# Altium schematic sheet ADPL_improved.SchDoc
size B
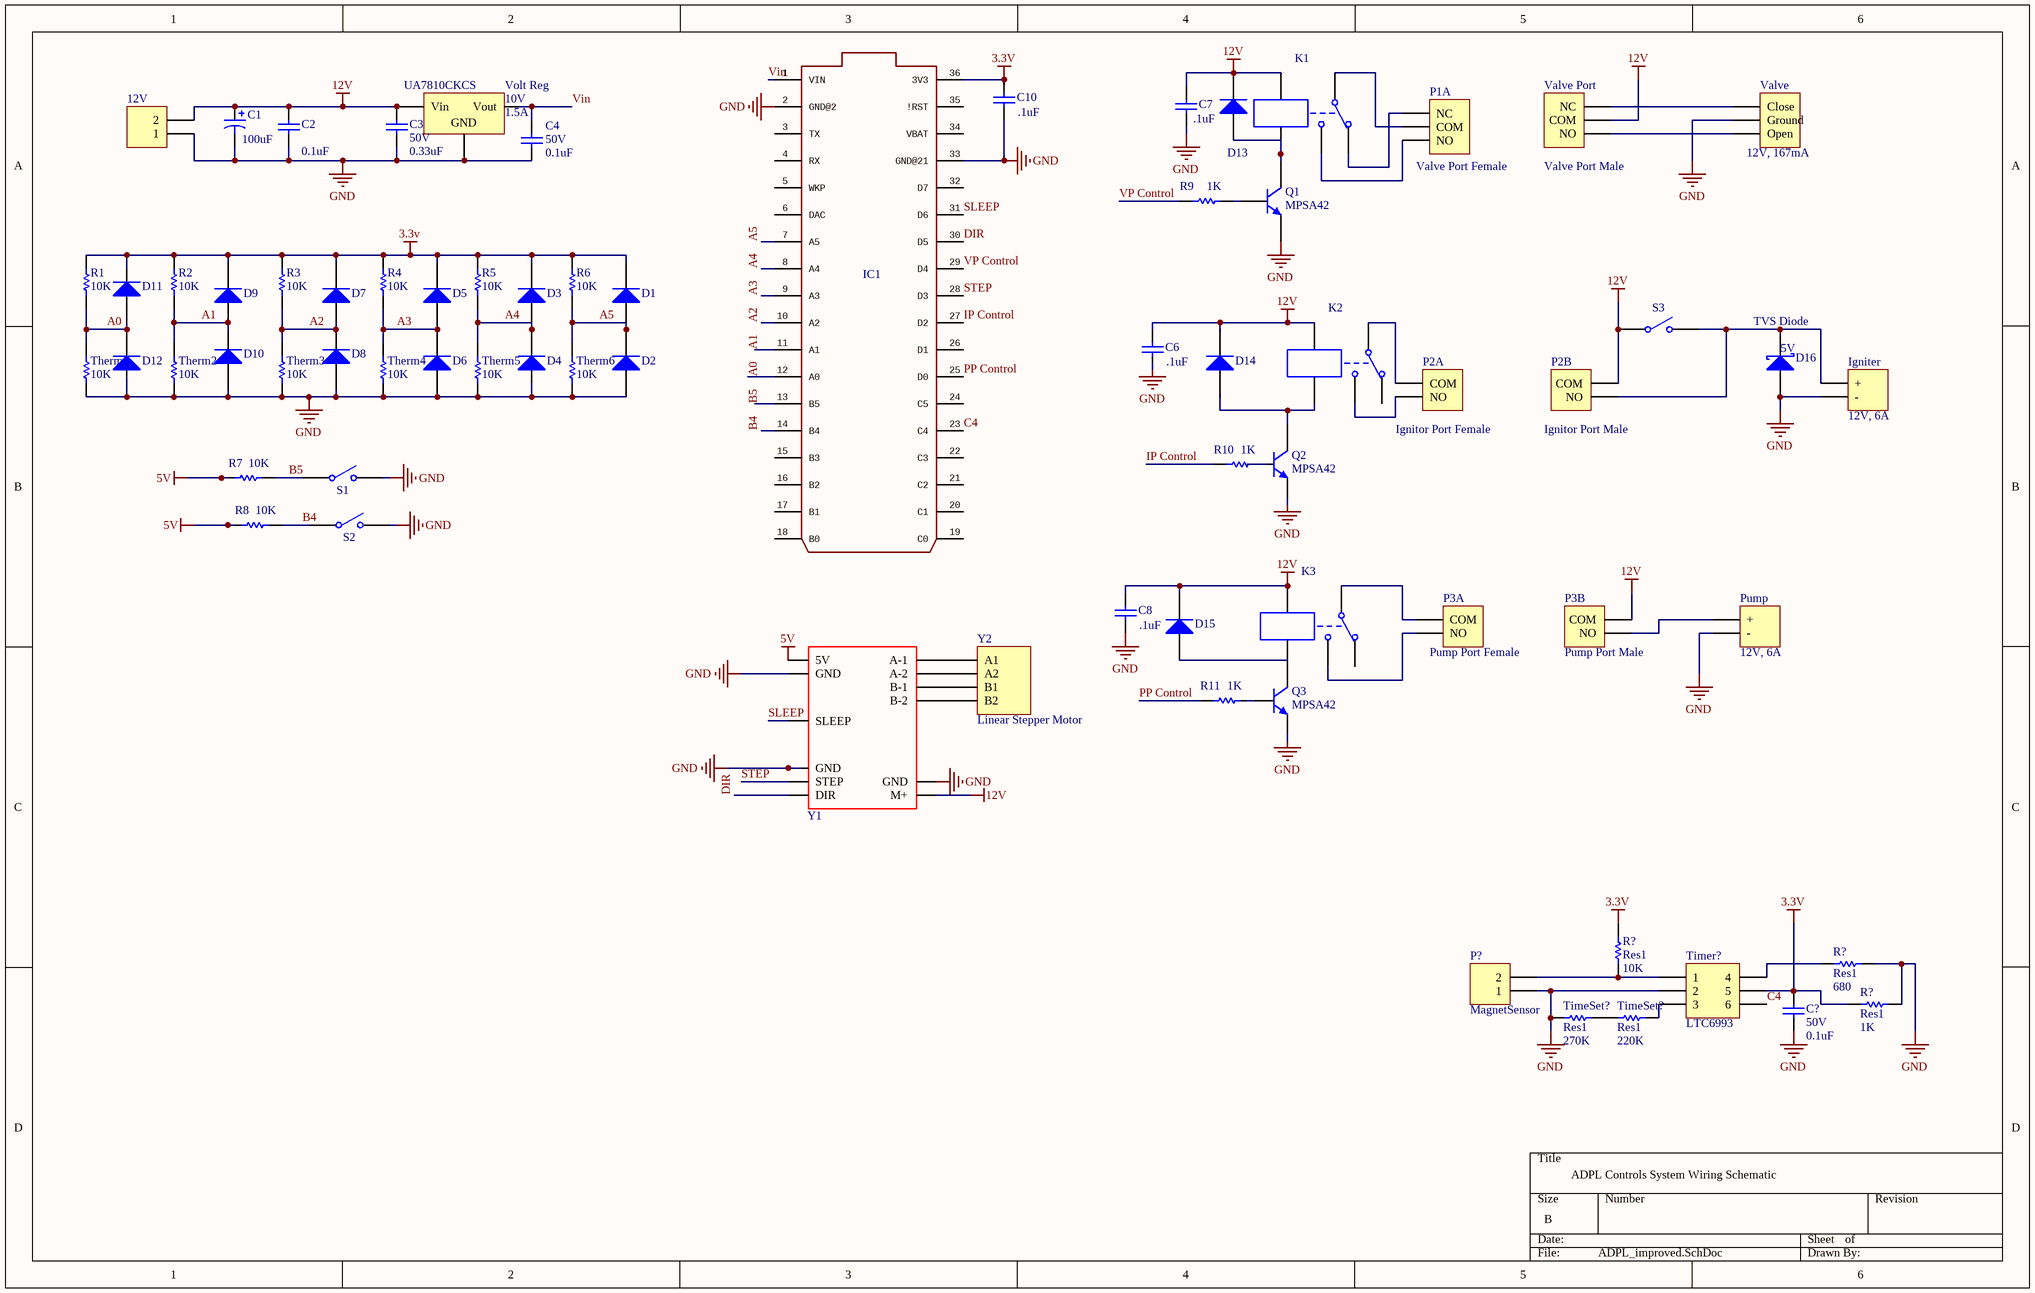
[diagram p0: ADPL_improved.SchDoc]

## Parts
(Parts that share a designator on the sheet are numbered #1, #2 ... from top to bottom, then left to right.)
12V  (no value)  [HDR1X2]
C1  value 100uF  [RB7.6-15]  (hidden comment: Cap)
C2  value 0.1uF  [C1206]  (hidden comment: Cap)
C3  50V  value 0.33uF  [RAD-0.3]
C4  50V  value 0.1uF  [RAD-0.3]
C6  value .1uF  [C1206]  (hidden comment: BYCap)
C7  value .1uF  [C1206]  (hidden comment: Cap)
C8  value .1uF  [C1206]  (hidden comment: BYCap)
C10  value .1uF  [C1206]  (hidden comment: BYCap)
C?  50V  value 0.1uF  [RAD-0.3]
D1  1N914  [DO-35]  (value not drawn)
D2  1N914  [DO-35]  (value not drawn)
D3  1N914  [DO-35]  (value not drawn)
D4  1N914  [DO-35]  (value not drawn)
D5  1N914  [DO-35]  (value not drawn)
D6  1N914  [DO-35]  (value not drawn)
D7  1N914  [DO-35]  (value not drawn)
D8  1N914  [DO-35]  (value not drawn)
D9  1N914  [DO-35]  (value not drawn)
D10  1N914  [DO-35]  (value not drawn)
D11  1N914  [DO-35]  (value not drawn)
D12  1N914  [DO-35]  (value not drawn)
D13  1N914  [DO-35]  (value not drawn)
D14  1N914  [DO-35]  (value not drawn)
D15  1N914  [DO-35]  (value not drawn)
D16  TVS Diode  Working Voltage: 5V  [TO-220AC]
IC1  Particle Electron  [ELECTRON]  (value not drawn)
Igniter  12V, 6A  [HDR1X2]
K1  Relay-SPDT  (value not drawn)
K2  Relay-SPDT  (value not drawn)
K3  Relay-SPDT  (value not drawn)
P1A  Valve Port Female
P2A  Ignitor Port Female
P2B  Ignitor Port Male
P3A  Pump Port Female
P3B  Pump Port Male
P?  MagnetSensor  [HDR1X2]
Pump  12V, 6A  [HDR1X2]
Q1  MPSA42  [TO-92A]
Q2  MPSA42  [TO-92A]
Q3  MPSA42  [TO-92A]
R1  value 10K  [AXIAL-0.3]  (hidden comment: Res1)
R2  value 10K  [AXIAL-0.3]  (hidden comment: Res1)
R3  value 10K  [AXIAL-0.3]  (hidden comment: Res1)
R4  value 10K  [AXIAL-0.3]  (hidden comment: Res1)
R5  value 10K  [AXIAL-0.3]  (hidden comment: Res1)
R6  value 10K  [AXIAL-0.3]  (hidden comment: Res1)
R7  value 10K  [AXIAL-0.3]  (hidden comment: Res1)
R8  value 10K  [AXIAL-0.3]  (hidden comment: Res1)
R9  value 1K  [AXIAL-0.3]  (hidden comment: Res1)
R10  value 1K  [AXIAL-0.3]  (hidden comment: R10)
R11  value 1K  [AXIAL-0.3]  (hidden comment: R11)
R?#1  Res1  value 10K  [AXIAL-0.3]
R?#2  Res1  value 680  [AXIAL-0.3]
R?#3  Res1  value 1K  [AXIAL-0.3]
S1  SW-SPST  [SPST-2]  (value not drawn)
S2  SW-SPST  [SPST-2]  (value not drawn)
S3  SW-SPST  [SPST-2]  (value not drawn)
Therm1  value 10K  [AXIAL-0.3]  (hidden comment: Res1)
Therm2  value 10K  [AXIAL-0.3]  (hidden comment: Res1)
Therm3  value 10K  [AXIAL-0.3]  (hidden comment: Res1)
Therm4  value 10K  [AXIAL-0.3]  (hidden comment: Res1)
Therm5  value 10K  [AXIAL-0.3]  (hidden comment: Res1)
Therm6  value 10K  [AXIAL-0.3]  (hidden comment: Res1)
Timer?  LTC6993  [LTC6993]
TimeSet?#1  Res1  value 270K  [AXIAL-0.3]
TimeSet?#2  Res1  value 220K  [AXIAL-0.3]
UA7810CKCS  Volt Reg  Voltage output: 10V  Current output: 1.5A  [D2PAK_N]
Valve  12V, 167mA  [HDR1X3]
Valve_Port  Valve Port Male
Y1  105990027  (value not drawn)
Y2  Linear Stepper Motor

## Nets
3.3V: C10.2 C?.1 D1.2(K) D3.2(K) D5.2(K) D7.2(K) D9.2(K) D11.2(K) IC1.36(3V3) R1.2 R2.2 R3.2 R4.2 R5.2 R6.2 R?#1.2 R?#3.2 Timer?.5
5V: R7.2 R8.2 Y1.?5(5V)
12V: 12V.2 C1.1 C2.2 C3.2 C6.2 C7.2 C8.2 D13.2(K) D14.2(K) D15.2(K) K1.4 K2.4 K3.4 P2B.2(COM) P3B.2(COM) S3.1(COMMON) UA7810CKCS.1(Vin) Valve_Port.2(COM) Y1.?7(M+)
GND: 12V.1 C1.2 C2.1 C3.1 C4.1 C6.1 C7.1 C8.1 C10.1 C?.2 D2.1(A) D4.1(A) D6.1(A) D8.1(A) D10.1(A) D12.1(A) D16.3(A) IC1.2(GND@2) IC1.33(GND@21) Igniter.2(-) P?.1 Pump.2(-) Q1.1(E) Q2.1(E) Q3.1(E) R?#2.1 R?#3.1 S1.2(NO) S2.2(NO) Therm1.1 Therm2.1 Therm3.1 Therm4.1 Therm5.1 Therm6.1 Timer?.2 TimeSet?#1.1 UA7810CKCS.2(GND) Valve.2(Ground) Y1.?1(GND) Y1.?6(GND) Y1.?8(GND)
A0: D11.1(A) D12.2(K) IC1.12(A0) R1.1 Therm1.2
A1: D9.1(A) D10.2(K) IC1.11(A1) R2.1 Therm2.2
A2: D7.1(A) D8.2(K) IC1.10(A2) R3.1 Therm3.2
A3: D5.1(A) D6.2(K) IC1.9(A3) R4.1 Therm4.2
A4: D3.1(A) D4.2(K) IC1.8(A4) R5.1 Therm5.2
A5: D1.1(A) D2.2(K) IC1.7(A5) R6.1 Therm6.2
B4: IC1.14(B4) R8.1 S2.1(COMMON)
B5: IC1.13(B5) R7.1 S1.1(COMMON)
C4: IC1.23(C4) Timer?.6
DIR: IC1.30(D5) Y1.?3(DIR)
IP Control: IC1.27(D2) R10.1
PP Control: IC1.25(D0) R11.1
SLEEP: IC1.31(D6) Y1.?4(SLEEP)
STEP: IC1.28(D3) Y1.?2(STEP)
Vin: C4.2 IC1.1(VIN) UA7810CKCS.3(Vout)
VP Control: IC1.29(D4) R9.1
NetD13_1: D13.1(A) K1.5 Q1.3(C)
NetD14_1: D14.1(A) K2.5 Q2.3(C)
NetD15_1: D15.1(A) Q3.3(C)
NetD16_1: D16.1(K) Igniter.1(+) P2B.1(NO) S3.2(NO)
NetK1_1: K1.1 P1A.2(COM)
NetK1_2: K1.2 P1A.1(NC)
NetK1_3: K1.3 P1A.3(NO)
NetK2_1: K2.1 P2A.1(COM)
NetK2_3: K2.3 P2A.2(NO)
NetK3_1: K3.1 P3A.1(COM)
NetK3_3: K3.3 P3A.2(NO)
NetP3B_1: P3B.1(NO) Pump.1(+)
NetP?_2: P?.2 R?#1.1 Timer?.1
NetQ1_2: Q1.2(B) R9.2
NetQ2_2: Q2.2(B) R10.2
NetQ3_2: Q3.2(B) R11.2
NetR?#2_2: R?#2.2 Timer?.4
NetTimer?_3: Timer?.3 TimeSet?#2.2
NetTimeSet?#1_2: TimeSet?#1.2 TimeSet?#2.1
NetValve_1: Valve.1(Close) Valve_Port.3(NC)
NetValve_3: Valve.3(Open) Valve_Port.1(NO)
NetY1_?9: Y1.?9(A-1) Y2.A1
NetY1_?10: Y1.?10(A-2) Y2.A2
NetY1_?11: Y1.?11(B-1) Y2.B1
NetY1_?12: Y1.?12(B-2) Y2.B2

Not connected (* = marked no-connect by the designer): IC1 3(TX) 4(RX) 5(WKP) 6(DAC) 15(B3) 16(B2) 17(B1) 18(B0) 19(C0) 20(C1) 21(C2) 22(C3) 24(C5) 26(D1) 32(D7) 34(VBAT) 35(!RST); K2 2; K3 2 5

## Notes on the sheet
- ADPL Controls System Wiring Schematic

## Library data of the parts
12V = Header 2: Header, 2-Pin; LatestRevisionDate: 17-Jul-2002; LatestRevisionNote: Re-released for DXP Platform.; Publisher: Altium Limited
C1 = Cap Pol1: Polarized Capacitor (Radial); Voltage Rating: 25V; Published: 8-Jun-2000; LatestRevisionDate: 17-Jul-2002; LatestRevisionNote: Re-released for DXP Platform.; PackageReference: RB7.6-15; Publisher: Altium Limited; PackageDescription: Polarized Capacitor (Radial); 2 Leads
C2 = Cap Semi: Capacitor (Semiconductor SIM Model); Part#: 581-SA111E104MAR; Voltage Rating: 100V; Published: 8-Jun-2000; LatestRevisionDate: 29-May-2009; LatestRevisionNote: IPC-7351 Footprint Added.; PackageReference: C1206; Publisher: Altium Limited; PackageDescription: Chip Capacitor
C3 C4 = Cap: Capacitor; Published: 8-Jun-2000; LatestRevisionDate: 17-Jul-2002; LatestRevisionNote: Re-released for DXP Platform.; PackageReference: RAD-0.3; Publisher: Altium Limited; PackageDescription: Radial Cap, Thru-Hole; 2 Leads; 0.3 in Pin Spacing
C6-C8 C10 = Cap Semi: Capacitor (Semiconductor SIM Model); Part#: 581-SA111E104MAR; Published: 8-Jun-2000; LatestRevisionDate: 29-May-2009; LatestRevisionNote: IPC-7351 Footprint Added.; PackageReference: C1206; Publisher: Altium Limited; PackageDescription: Chip Capacitor
C? = cap: Capacitor; Published: 8-Jun-2000; LatestRevisionDate: 17-Jul-2002; LatestRevisionNote: Re-released for DXP Platform.; PackageReference: RAD-0.3; Publisher: Altium Limited; PackageDescription: Radial Cap, Thru-Hole; 2 Leads; 0.3 in Pin Spacing
D1-D15 = Diode 1N914: High Conductance Fast Diode; Published: 8-Jun-2000; LatestRevisionDate: 17-Jul-2002; LatestRevisionNote: Re-released for DXP Platform.; DatasheetVersion: 1997; PackageReference: DO-35; Publisher: Altium Limited; PackageDescription: Diode, Axial; Body 3.8 x 1.9 mm (LxDia. max), Lead Dia. 0.53 mm (max); Code_JEDEC: DO-204-AH; ComponentLink1Description: Manufacturer Link; ComponentLink1URL: http://www.fairchildsemi.com/; ComponentLink2Description: Datasheet; ComponentLink2URL: http://www.fairchildsemi.com/ds/1N%2F1N4448.pdf
D16 = Diode 10TQ040: TVS Diode - Birectional; Part#: SA5.0CA; Note: Terminal 2 is the TAB and is electrically connected to the cathode; Clamping voltage: 9.6V; Published: 8-Jun-2000; LatestRevisionDate: 17-Jul-2002; LatestRevisionNote: Re-released for DXP Platform.; DatasheetVersion: PD-2.057B; PackageVersion: Feb-1998; PackageReference: TO-220AC; Publisher: Altium Limited; PackageDescription: TO, Thru-Hole, Vertical, Heatsink Mounted; 3 In-Line Leads (1 Absent); Pitch 2.54 mm; ComponentLink1Description: Manufacturer Link; ComponentLink1URL: http://www.irf.com/
IC1 = ELECTRON_WITH_HEADERS
Igniter Pump = Header 2: Header, 2-Pin; Input: 1.5VDC, 280-320mA; LatestRevisionDate: 17-Jul-2002; LatestRevisionNote: Re-released for DXP Platform.; Publisher: Altium Limited
K1-K3 = Relay-SPDT: Single-Pole Dual-Throw Relay; Part Number: SRD12SLA; Contact Capacity: 10A; Inductive Load: 5A; Published: 24-Mar-1999; LatestRevisionDate: 17-Jul-2002; LatestRevisionNote: Re-released for DXP Platform.; PackageReference: MODULE5B; Publisher: Altium Limited
P1A Valve = Header 3: Header, 3-Pin; Part#: CWX-15Q, CR-02; LatestRevisionDate: 17-Jul-2002; LatestRevisionNote: Re-released for DXP Platform.; Publisher: Altium Limited
P2A = Header 2: Header, 2-Pin; Aaron's Comment: 1.5V, 280-320mA; LatestRevisionDate: 17-Jul-2002; LatestRevisionNote: Re-released for DXP Platform.; Publisher: Altium Limited
P2B P3B = Header 2: LatestRevisionDate: 17-Jul-2002; LatestRevisionNote: Re-released for DXP Platform.; Publisher: Altium Limited
P3A = Header 2: Header, 2-Pin; Aaron's Comment: 12V, 6A; LatestRevisionDate: 17-Jul-2002; LatestRevisionNote: Re-released for DXP Platform.; Publisher: Altium Limited
P? = Header 2: Header, 2-Pin; Resistance: Contact on maximum resistance: ≤10kΩ   Open contact minimum resistance: ≥500kΩ; LatestRevisionDate: 17-Jul-2002; LatestRevisionNote: Re-released for DXP Platform.; Publisher: Altium Limited; Source: http://www.amazon.com/GERI-Counter-Digital-Proximity-Magnetic/dp/B01875612U/ref=sr_1_2?ie=UTF8&qid=1456764906&sr=8-2&keywords=magnetic+counter
Q1-Q3 = 2N3904: NPN General Purpose Amplifier; Part#: 512-MPSA42; Published: 8-Jun-2000; LatestRevisionDate: 17-Jan-2003; LatestRevisionNote: PCB Footprint replaced; DatasheetVersion: 1997; PackageVersion: Sep-1998; PackageReference: TO-92A; Publisher: Altium Limited; PackageDescription: TO, Flat Index; 3 In-Line, Axial Leads; Body Dia. 4.5mm; Leads 0.51 x 0.48 mm (max); ComponentLink1Description: Manufacturer Link; ComponentLink1URL: http://www.fairchildsemi.com/; ComponentLink2Description: Datasheet; ComponentLink2URL: http://www.fairchildsemi.com/ds/2N%2F2N3904.pdf
R1-R11 R?#1 = Res1: Resistor; Published: 8-Jun-2000; LatestRevisionDate: 17-Jul-2002; LatestRevisionNote: Re-released for DXP Platform.; PackageReference: AXIAL-0.3; Publisher: Altium Limited; PackageDescription: Axial Device, Thru-Hole; 2 Leads; 0.3 in Pin Spacing
R?#2 = Res1: Resistor; Part#: 660-CF1/4C681J; Published: 8-Jun-2000; LatestRevisionDate: 17-Jul-2002; LatestRevisionNote: Re-released for DXP Platform.; PackageReference: AXIAL-0.3; Publisher: Altium Limited; PackageDescription: Axial Device, Thru-Hole; 2 Leads; 0.3 in Pin Spacing
R?#3 = Res1: Resistor; Part#: 660-CF1/4CT52R102J; Published: 8-Jun-2000; LatestRevisionDate: 17-Jul-2002; LatestRevisionNote: Re-released for DXP Platform.; PackageReference: AXIAL-0.3; Publisher: Altium Limited; PackageDescription: Axial Device, Thru-Hole; 2 Leads; 0.3 in Pin Spacing
S1-S3 = SW-SPST: Single-Pole, Single-Throw Switch; Published: 24-Mar-1999; LatestRevisionDate: 17-Jul-2002; LatestRevisionNote: Re-released for DXP Platform.; PackageReference: SPST-2; Publisher: Altium Limited; PackageDescription: Switch; 2 Leads
Therm1 Therm2 Therm4-Therm6 = Res1: Resistor; Part#: NTCAIMME3C90373; Published: 8-Jun-2000; LatestRevisionDate: 17-Jul-2002; LatestRevisionNote: Re-released for DXP Platform.; PackageReference: AXIAL-0.3; Publisher: Altium Limited; PackageDescription: Axial Device, Thru-Hole; 2 Leads; 0.3 in Pin Spacing
Therm3 = Res1: Resistor; Part#: Dwyer I2-1B062; Published: 8-Jun-2000; LatestRevisionDate: 17-Jul-2002; LatestRevisionNote: Re-released for DXP Platform.; PackageReference: AXIAL-0.3; Publisher: Altium Limited; PackageDescription: Axial Device, Thru-Hole; 2 Leads; 0.3 in Pin Spacing
TimeSet?#1 = Res1: Resistor; Part#: 660-CF1/4CT52R274J; Published: 8-Jun-2000; LatestRevisionDate: 17-Jul-2002; LatestRevisionNote: Re-released for DXP Platform.; PackageReference: AXIAL-0.3; Publisher: Altium Limited; PackageDescription: Axial Device, Thru-Hole; 2 Leads; 0.3 in Pin Spacing
TimeSet?#2 = Res1: Resistor; Part#: 660-CF1/4CT52R224J; Published: 8-Jun-2000; LatestRevisionDate: 17-Jul-2002; LatestRevisionNote: Re-released for DXP Platform.; PackageReference: AXIAL-0.3; Publisher: Altium Limited; PackageDescription: Axial Device, Thru-Hole; 2 Leads; 0.3 in Pin Spacing
UA7810CKCS = Volt Reg: Voltage Regulator; Part#: UA7810CKCS; Voltage input: 12.5-28V; Published: 24-Mar-1999; LatestRevisionDate: 29-May-2009; LatestRevisionNote: IPC-7351 Footprint Added.; PackageReference: D2PAK; Publisher: Altium Limited; PackageDescription: 3-Pin Transistor Outline Package 2.54 mm Pitch, 15.1 mm Lead Span
Valve_Port = Header 3: Header, 3-Pin; Part#: CWX-15Q, CR-02; Aaron's Comment: 12V, 167 mA; LatestRevisionDate: 17-Jul-2002; LatestRevisionNote: Re-released for DXP Platform.; Publisher: Altium Limited
Y1 = EasyDriver: EASY DRIVER STEPPER MOTOR DRIVER; Manufacturer: Seeed Technology Co.; Expanded Description: A3967 - Power Management, Motor Control, Stepper Evaluation Board; Mounting Technology: Header; PartNumber: 105990027; DigiKey Part #: 1597-1403-ND
Y2 = Nema Non-captive Linear Stepper Motor: This is a linear stepper motor which named Nema 23 Non-captive linear actuator, it was composed of 56mm 2A Nema 23 stepper motor and 150mm length Tr11x2 linear screw.; Part Number: 23LS22-2004N-150T; Rated Current: 2.0A; 24-36V: Recommended Voltage; ComponentLink1Description: Manufacturer URL; ComponentLink2URL: http://industrial.panasonic.com/www-data/pdf/AEA5000/AEA5000CE4.pdf; ComponentLink2Description: Datasheet; ComponentLink1URL: http://www.omc-stepperonline.com/nema-23-noncaptive-linear-stepper-motor-56mm-body-150mm-lead-screw-t11-x-2-p-150.html